# EasyEDA schematic SCH_More-PCB_2025-03-30.json
TITLE: Sheet_1; REV: 1.0; Date: 2025-03-30; Sheet: 1/1; Drawn By: writetoaaradhya; Company: Your Company
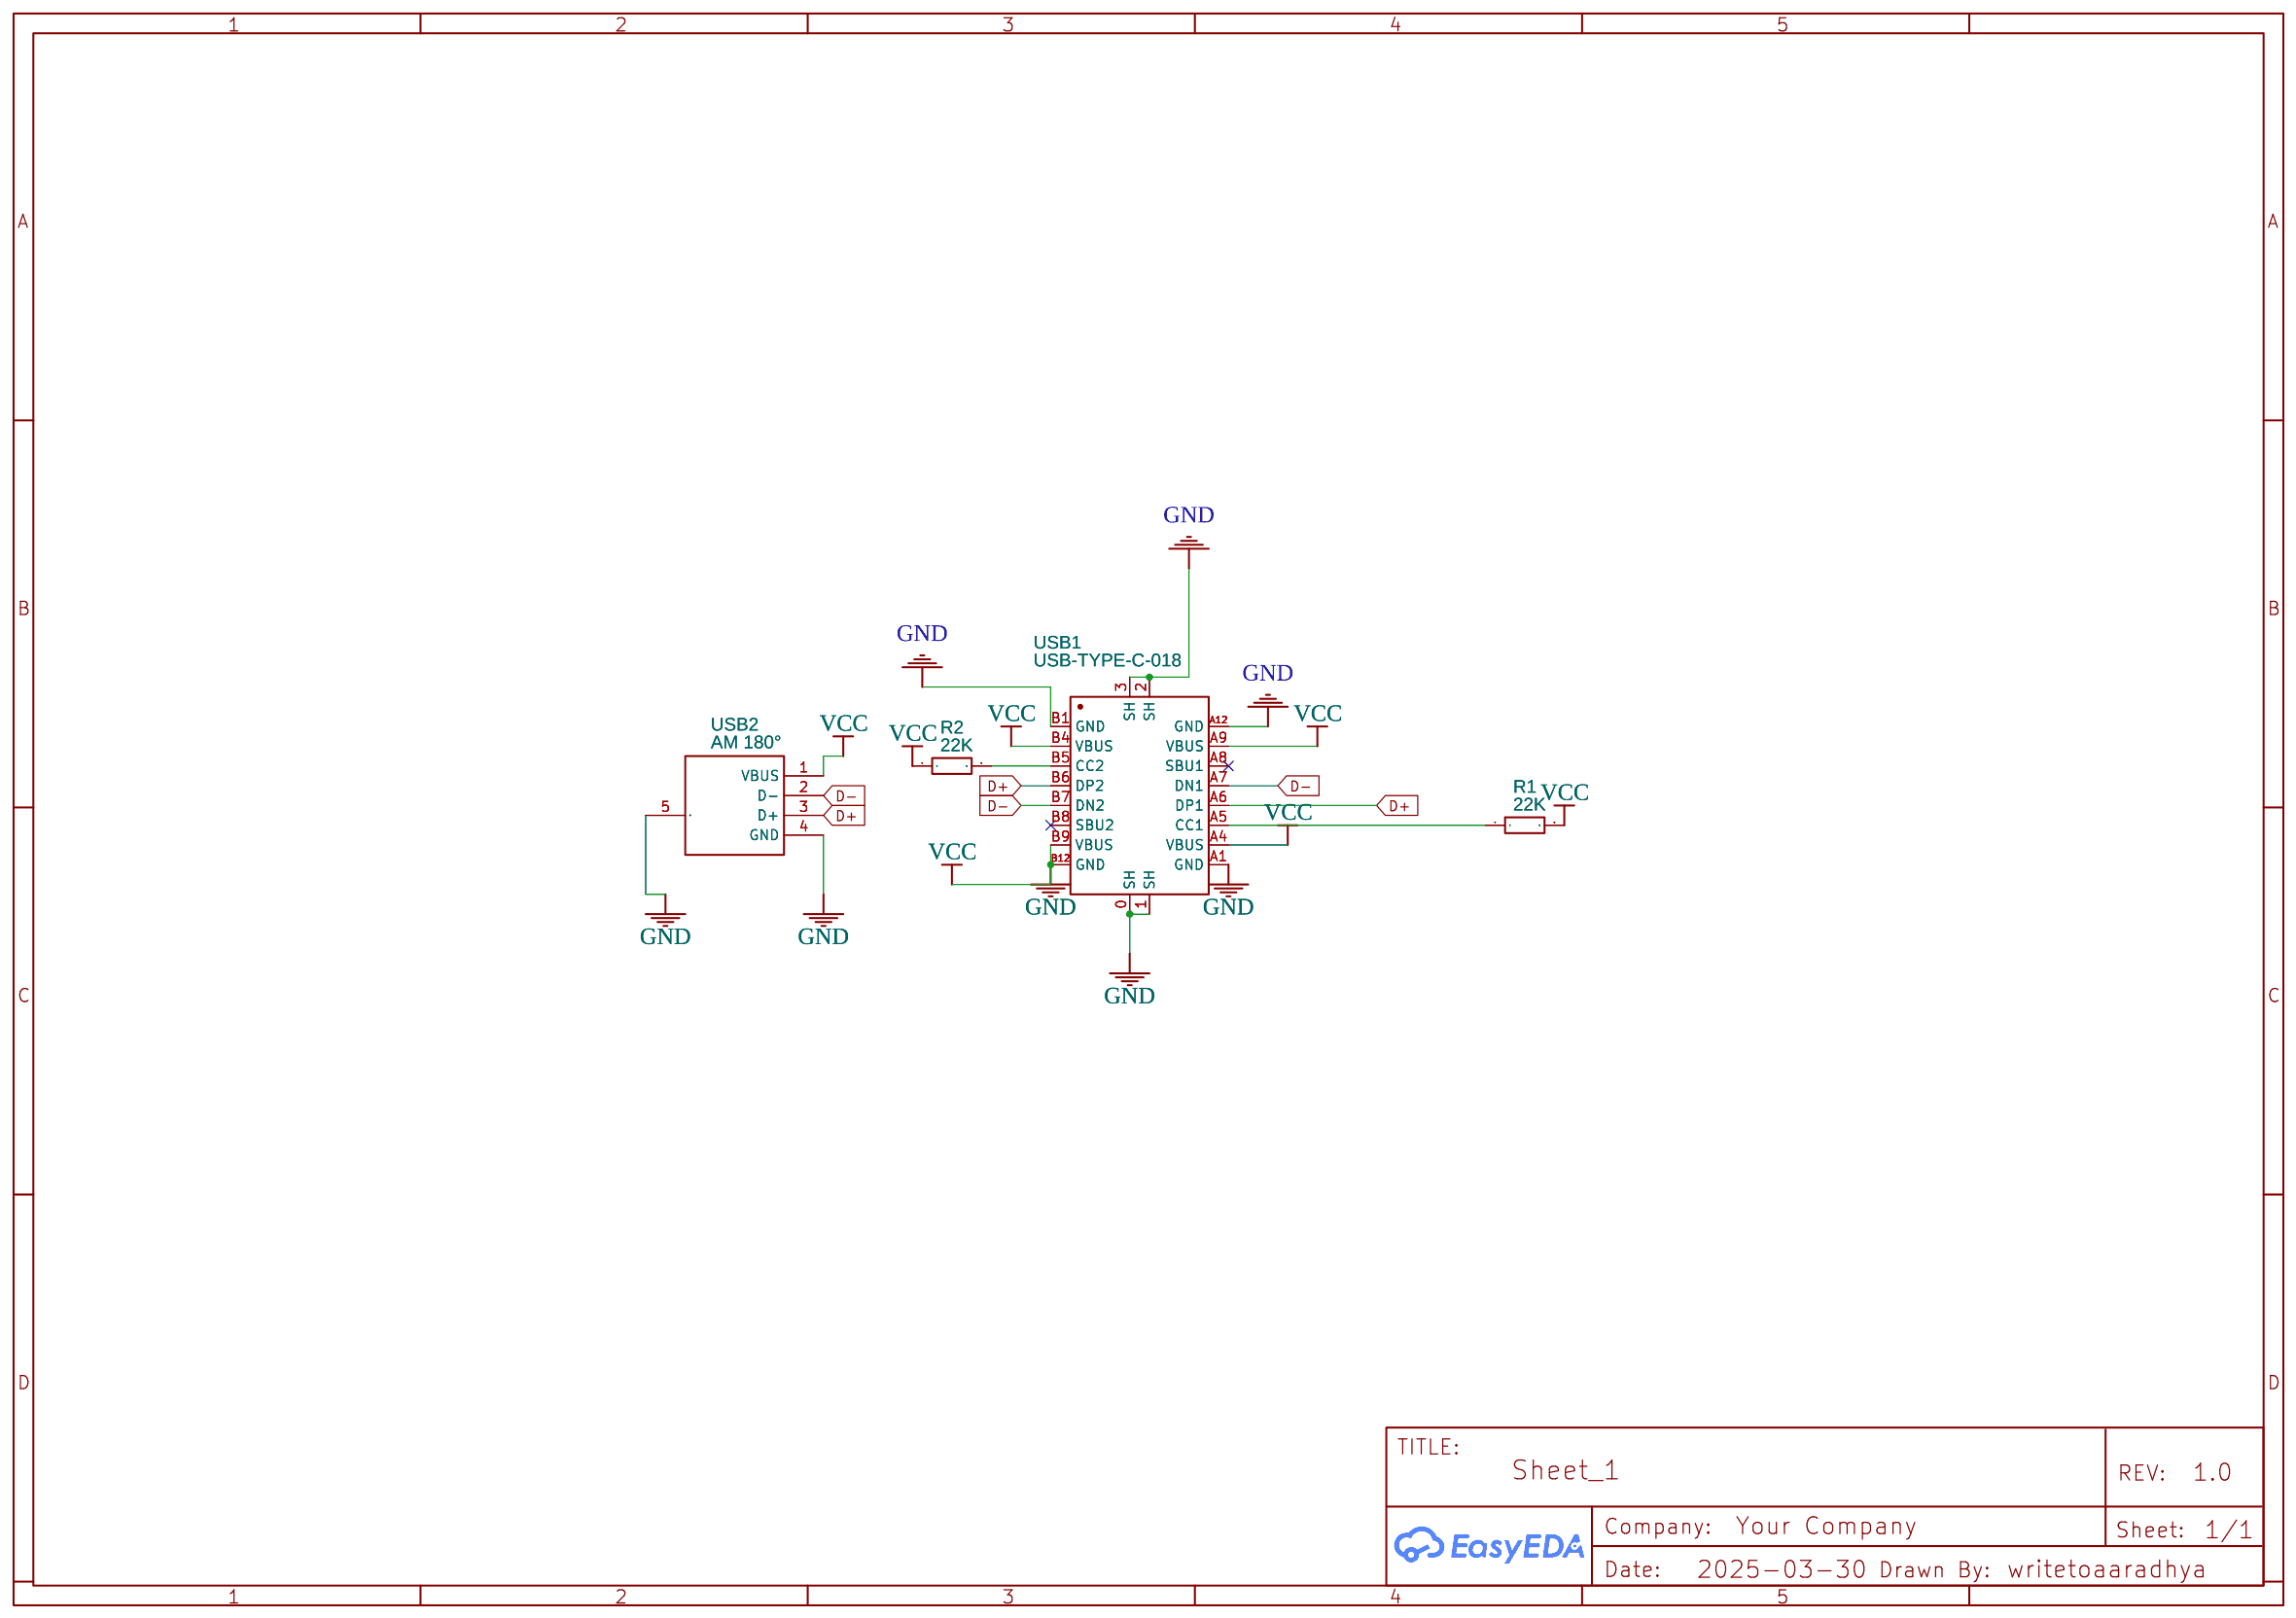
[diagram p0: schematic sheet]

## Parts
R1  22K  [R0402]
R2  22K  [R0402]
USB1  USB-TYPE-C-018  [USB-C_SMD-TYPE-C-31-M-12]
USB2  AM 180°  [USB-SMD_AM180]

## Library data of the parts
R1 R2 = ERTJ0ER223J: Contributor: LCSC; Supplier: LCSC; Supplier Part: C336816; Manufacturer: PANASONIC(松下); JLCPCB Part Class: Extended Part
USB1 = USB-TYPE-C-018: Contributor: LCSC; Supplier: LCSC; Supplier Part: C2927038; Manufacturer: DEALON(德艺隆); JLCPCB Part Class: Extended Part
USB2 = AM 180°: Contributor: LCSC; Supplier: LCSC; Supplier Part: C2681564; Manufacturer: SHOU HAN(首韩)

## Nets
GND: R1.2 R2.1 USB1.0(SH) USB1.1(SH) USB1.2(SH) USB1.3(SH) USB1.A1(GND) USB1.A4(VBUS) USB1.A9(VBUS) USB1.A12(GND) USB1.B1(GND) USB1.B4(VBUS) USB1.B9(VBUS) USB1.B12(GND) USB2.1(VBUS) USB2.4(GND) USB2.5(EH)
D+: USB1.A6(DP1) USB1.B6(DP2) USB2.3(D+)
D-: USB1.A7(DN1) USB1.B7(DN2) USB2.2(D-)
Net-(R1-1): R1.1 USB1.A5(CC1)
Net-(R2-2): R2.2 USB1.B5(CC2)

Not connected (* = marked no-connect by the designer): USB1 A8(SBU1)* B8(SBU2)*
